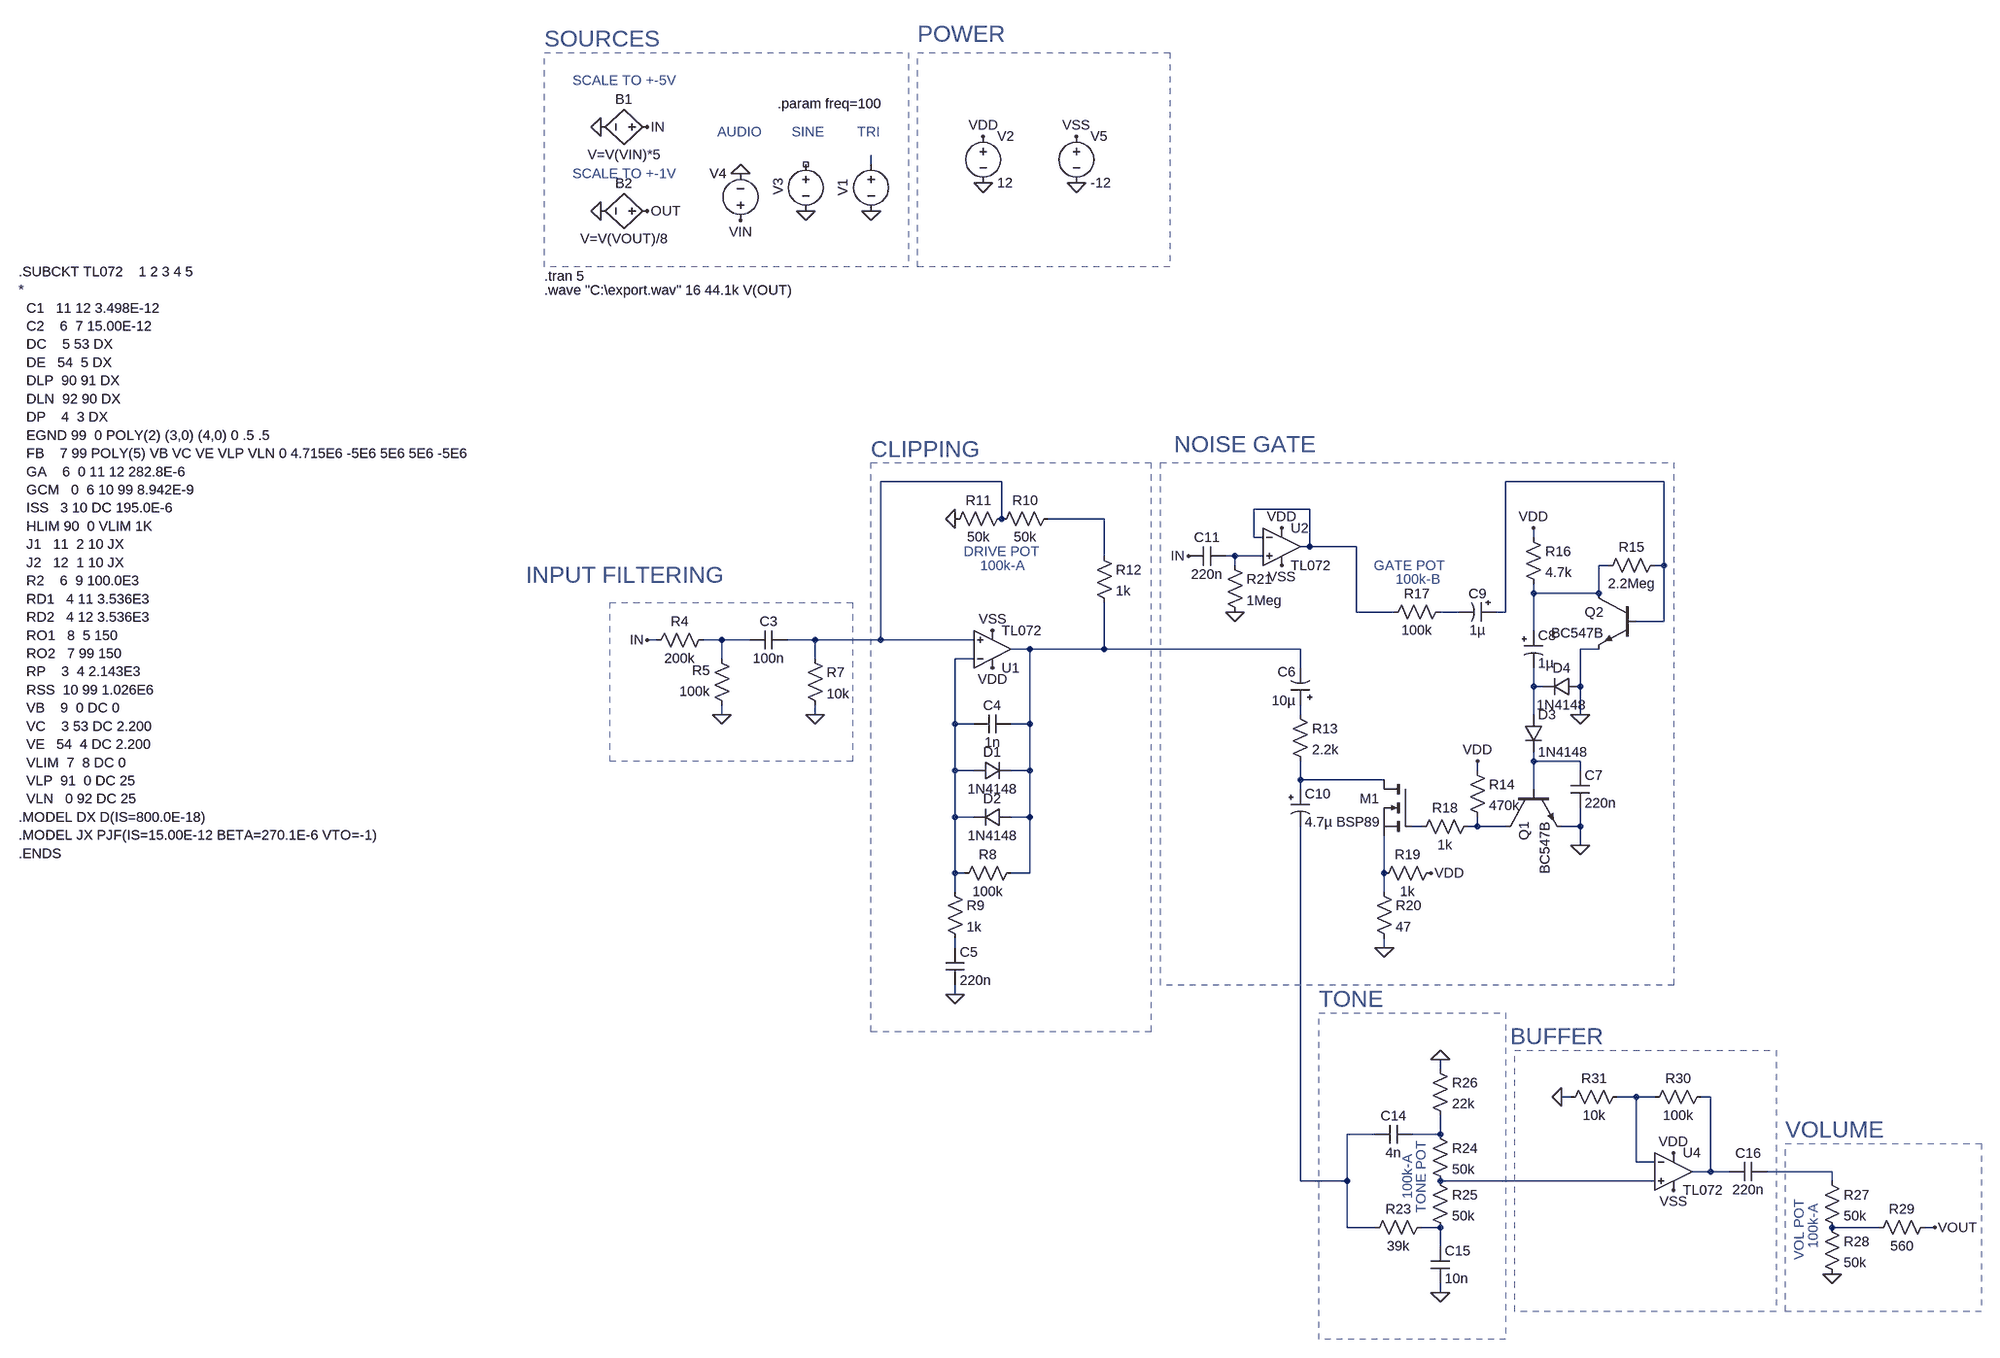
[diagram p0: schematic wrmergle.asc]
wrmergle.asc, the LTspice schematic file:
Version 4
SHEET 1 2852 1756
WIRE -112 -368 -112 -384
WIRE 112 176 -96 176
WIRE 1248 176 976 176
WIRE 640 224 544 224
WIRE 112 240 112 176
WIRE 288 240 192 240
WIRE 544 272 544 224
WIRE 560 272 544 272
WIRE 1024 272 1024 256
WIRE 640 288 640 224
WIRE 640 288 624 288
WIRE 720 288 640 288
WIRE 288 304 288 240
WIRE 512 304 496 304
WIRE 560 304 512 304
WIRE 512 320 512 304
WIRE 1152 320 1136 320
WIRE 1248 320 1248 176
WIRE 1248 320 1232 320
WIRE 1024 368 1024 352
WIRE 1136 368 1136 320
WIRE 1136 368 1024 368
WIRE 720 400 720 288
WIRE 784 400 720 400
WIRE 896 400 864 400
WIRE 976 400 976 176
WIRE 976 400 960 400
WIRE 1248 416 1248 320
WIRE 1248 416 1200 416
WIRE 1024 432 1024 368
WIRE -480 448 -496 448
WIRE -368 448 -400 448
WIRE -320 448 -368 448
WIRE -208 448 -256 448
WIRE -96 448 -96 176
WIRE -96 448 -208 448
WIRE 64 448 -96 448
WIRE 160 464 128 464
WIRE 288 464 288 384
WIRE 288 464 160 464
WIRE 624 464 288 464
WIRE 1136 464 1104 464
WIRE -368 480 -368 448
WIRE -208 480 -208 448
WIRE 64 480 32 480
WIRE 624 496 624 464
WIRE 1024 528 1024 496
WIRE 1040 528 1024 528
WIRE 1104 528 1104 464
WIRE -368 576 -368 560
WIRE -208 576 -208 560
WIRE 624 576 624 560
WIRE 1024 576 1024 528
WIRE 1104 576 1104 528
WIRE 32 592 32 480
WIRE 64 592 32 592
WIRE 160 592 160 464
WIRE 160 592 128 592
WIRE 1024 656 1024 640
WIRE 1104 656 1024 656
WIRE 32 672 32 592
WIRE 64 672 32 672
WIRE 160 672 160 592
WIRE 160 672 128 672
WIRE 928 672 928 656
WIRE 1104 672 1104 656
WIRE 624 688 624 656
WIRE 768 688 624 688
WIRE 624 704 624 688
WIRE 1024 704 1024 656
WIRE 32 752 32 672
WIRE 64 752 32 752
WIRE 160 752 160 672
WIRE 160 752 128 752
WIRE 832 768 816 768
WIRE 928 768 928 752
WIRE 928 768 912 768
WIRE 976 768 928 768
WIRE 1104 768 1104 736
WIRE 1104 768 1072 768
WIRE 1104 800 1104 768
WIRE 32 848 32 752
WIRE 48 848 32 848
WIRE 160 848 160 752
WIRE 160 848 128 848
WIRE 768 848 768 784
WIRE 32 880 32 848
WIRE 768 880 768 848
WIRE 32 976 32 960
WIRE 768 976 768 960
WIRE 32 1056 32 1040
WIRE 864 1184 864 1168
WIRE 1088 1232 1072 1232
WIRE 1200 1232 1168 1232
WIRE 1232 1232 1200 1232
WIRE 1328 1232 1312 1232
WIRE 752 1296 704 1296
WIRE 864 1296 864 1264
WIRE 864 1296 816 1296
WIRE 1200 1344 1200 1232
WIRE 1232 1344 1200 1344
WIRE 1328 1360 1328 1232
WIRE 1328 1360 1296 1360
WIRE 1360 1360 1328 1360
WIRE 1536 1360 1424 1360
WIRE 624 1376 624 768
WIRE 704 1376 704 1296
WIRE 704 1376 624 1376
WIRE 1232 1376 864 1376
WIRE 1536 1376 1536 1360
WIRE 704 1456 704 1376
WIRE 752 1456 704 1456
WIRE 864 1456 832 1456
WIRE 1616 1456 1536 1456
WIRE 1712 1456 1696 1456
WIRE 864 1488 864 1456
WIRE 864 1568 864 1552
FLAG -336 -272 VIN
FLAG -496 -432 IN
FLAG -496 -288 OUT
FLAG -496 448 IN
FLAG 1712 1456 VOUT
FLAG 1264 1328 VDD
FLAG 1264 1392 VSS
FLAG 96 432 VSS
FLAG 96 496 VDD
FLAG 928 656 VDD
FLAG 1024 256 VDD
FLAG 592 256 VDD
FLAG 592 320 VSS
FLAG 848 848 VDD
FLAG 432 304 IN
FLAG 240 -336 0
FLAG 80 -336 0
FLAG 80 -416 VDD
FLAG 240 -416 VSS
FLAG -576 -288 0
FLAG -576 -432 0
FLAG -336 -352 0
FLAG -224 -288 0
FLAG -112 -288 0
FLAG 32 240 0
FLAG 32 1056 0
FLAG -208 576 0
FLAG -368 576 0
FLAG 512 400 0
FLAG 768 976 0
FLAG 1104 800 0
FLAG 1104 576 0
FLAG 864 1568 0
FLAG 864 1168 0
FLAG 1072 1232 0
FLAG 1536 1536 0
SYMBOL voltage -112 -384 R0
WINDOW 0 -32 56 VBottom 2
WINDOW 3 32 56 Invisible 2
WINDOW 123 0 0 Left 0
WINDOW 39 0 0 Left 0
SYMATTR InstName V1
SYMATTR Value PULSE(0 250m 0 {0.5/freq} {0.5/freq} 0 {1/freq})
SYMBOL voltage -224 -384 R0
WINDOW 0 -47 39 VRight 2
WINDOW 3 24 96 Invisible 2
WINDOW 123 0 0 Left 0
WINDOW 39 0 0 Left 0
SYMATTR InstName V3
SYMATTR Value SINE(0 1 {freq})
SYMBOL voltage -336 -256 R180
WINDOW 0 24 96 Left 2
WINDOW 3 24 16 Invisible 2
SYMATTR InstName V4
SYMATTR Value wavefile="C:\input.wav" chan=0
SYMBOL bv -480 -432 R90
WINDOW 0 -32 56 VBottom 2
WINDOW 3 32 56 VTop 2
SYMATTR InstName B1
SYMATTR Value V=V(VIN)*5
SYMBOL bv -480 -288 R90
WINDOW 0 -32 56 VBottom 2
WINDOW 3 32 56 VTop 2
SYMATTR InstName B2
SYMATTR Value V=V(VOUT)/8
SYMBOL res -384 432 R90
WINDOW 0 0 56 VBottom 2
WINDOW 3 32 56 VTop 2
SYMATTR InstName R4
SYMATTR Value 200k
SYMBOL res -352 576 R180
WINDOW 0 36 76 Left 2
WINDOW 3 36 40 Left 2
SYMATTR InstName R5
SYMATTR Value 100k
SYMBOL res 848 1440 R90
WINDOW 0 0 56 VBottom 2
WINDOW 3 32 56 VTop 2
SYMATTR InstName R23
SYMATTR Value 39k
SYMBOL cap 816 1280 R90
WINDOW 0 0 32 VBottom 2
WINDOW 3 32 32 VTop 2
SYMATTR InstName C14
SYMATTR Value 4n
SYMBOL res 848 1280 R0
SYMATTR InstName R24
SYMATTR Value 50k
SYMBOL res 848 1360 R0
SYMATTR InstName R25
SYMATTR Value 50k
SYMBOL res 848 1168 R0
SYMATTR InstName R26
SYMATTR Value 22k
SYMBOL cap 848 1488 R0
SYMATTR InstName C15
SYMATTR Value 10n
SYMBOL cap 1424 1344 R90
WINDOW 0 0 32 VBottom 2
WINDOW 3 32 32 VTop 2
SYMATTR InstName C16
SYMATTR Value 220n
SYMBOL res 1520 1360 R0
SYMATTR InstName R27
SYMATTR Value 50k
SYMBOL res 1520 1440 R0
SYMATTR InstName R28
SYMATTR Value 50k
SYMBOL res 1712 1440 R90
WINDOW 0 0 56 VBottom 2
WINDOW 3 32 56 VTop 2
SYMATTR InstName R29
SYMATTR Value 560
SYMBOL OpAmps\\opamp2 1264 1296 R0
SYMATTR InstName U4
SYMATTR Value TL072
SYMBOL res 1328 1216 R90
WINDOW 0 0 56 VBottom 2
WINDOW 3 32 56 VTop 2
SYMATTR InstName R30
SYMATTR Value 100k
SYMBOL res 1184 1216 R90
WINDOW 0 0 56 VBottom 2
WINDOW 3 32 56 VTop 2
SYMATTR InstName R31
SYMATTR Value 10k
SYMBOL OpAmps\\opamp2 96 528 M180
SYMATTR InstName U1
SYMATTR Value TL072
SYMBOL cap 128 576 R90
WINDOW 0 0 32 VBottom 2
WINDOW 3 32 32 VTop 2
SYMATTR InstName C4
SYMATTR Value 1n
SYMBOL diode 64 688 R270
WINDOW 0 32 32 VTop 2
WINDOW 3 0 32 VBottom 2
SYMATTR InstName D1
SYMATTR Value 1N4148
SYMBOL diode 128 736 R90
WINDOW 0 0 32 VBottom 2
WINDOW 3 32 32 VTop 2
SYMATTR InstName D2
SYMATTR Value 1N4148
SYMBOL res 144 832 R90
WINDOW 0 0 56 VBottom 2
WINDOW 3 32 56 VTop 2
SYMATTR InstName R8
SYMATTR Value 100k
SYMBOL res 16 864 R0
SYMATTR InstName R9
SYMATTR Value 1k
SYMBOL cap 16 976 R0
SYMATTR InstName C5
SYMATTR Value 220n
SYMBOL res 208 224 R90
WINDOW 0 0 56 VBottom 2
WINDOW 3 32 56 VTop 2
SYMATTR InstName R10
SYMATTR Value 50k
SYMBOL res 128 224 R90
WINDOW 0 0 56 VBottom 2
WINDOW 3 32 56 VTop 2
SYMATTR InstName R11
SYMATTR Value 50k
SYMBOL res 272 288 R0
SYMATTR InstName R12
SYMATTR Value 1k
SYMBOL cap -256 432 R90
WINDOW 0 0 32 VBottom 2
WINDOW 3 32 32 VTop 2
SYMATTR InstName C3
SYMATTR Value 100n
SYMBOL res -224 464 R0
SYMATTR InstName R7
SYMATTR Value 10k
SYMBOL polcap 640 560 R180
WINDOW 0 24 57 Left 2
WINDOW 3 24 8 Left 2
SYMATTR InstName C6
SYMATTR Value 10µ
SYMBOL res 608 560 R0
SYMATTR InstName R13
SYMATTR Value 2.2k
SYMBOL nmos 816 688 M0
SYMATTR InstName M1
SYMATTR Value BSP89
SYMBOL res 912 656 R0
SYMATTR InstName R14
SYMATTR Value 470k
SYMBOL npn 976 704 M90
SYMATTR InstName Q1
SYMATTR Value BC547B
SYMBOL cap 1088 672 R0
SYMATTR InstName C7
SYMATTR Value 220n
SYMBOL diode 1008 576 R0
SYMATTR InstName D3
SYMATTR Value 1N4148
SYMBOL diode 1104 512 R90
WINDOW 0 0 32 VBottom 2
WINDOW 3 32 32 VTop 2
SYMATTR InstName D4
SYMATTR Value 1N4148
SYMBOL polcap 1008 432 R0
SYMATTR InstName C8
SYMATTR Value 1µ
SYMBOL npn 1200 368 M0
SYMATTR InstName Q2
SYMATTR Value BC547B
SYMBOL res 1248 304 R90
WINDOW 0 0 56 VBottom 2
WINDOW 3 32 56 VTop 2
SYMATTR InstName R15
SYMATTR Value 2.2Meg
SYMBOL res 1008 256 R0
SYMATTR InstName R16
SYMATTR Value 4.7k
SYMBOL polcap 960 384 R90
WINDOW 0 0 32 VBottom 2
WINDOW 3 32 32 VTop 2
SYMATTR InstName C9
SYMATTR Value 1µ
SYMBOL res 880 384 R90
WINDOW 0 0 56 VBottom 2
WINDOW 3 32 56 VTop 2
SYMATTR InstName R17
SYMATTR Value 100k
SYMBOL OpAmps\\opamp2 592 224 R0
SYMATTR InstName U2
SYMATTR Value TL072
SYMBOL polcap 608 704 R0
SYMATTR InstName C10
SYMATTR Value 4.7µ
SYMBOL res 928 752 R90
WINDOW 0 0 56 VBottom 2
WINDOW 3 32 56 VTop 2
SYMATTR InstName R18
SYMATTR Value 1k
SYMBOL res 864 832 R90
WINDOW 0 0 56 VBottom 2
WINDOW 3 32 56 VTop 2
SYMATTR InstName R19
SYMATTR Value 1k
SYMBOL res 752 864 R0
SYMATTR InstName R20
SYMATTR Value 47
SYMBOL cap 496 288 R90
WINDOW 0 0 32 VBottom 2
WINDOW 3 32 32 VTop 2
SYMATTR InstName C11
SYMATTR Value 220n
SYMBOL res 496 304 R0
SYMATTR InstName R21
SYMATTR Value 1Meg
SYMBOL voltage 80 -432 R0
WINDOW 123 0 0 Left 0
WINDOW 39 0 0 Left 0
SYMATTR InstName V2
SYMATTR Value 12
SYMBOL voltage 240 -432 R0
WINDOW 123 0 0 Left 0
WINDOW 39 0 0 Left 0
SYMATTR InstName V5
SYMATTR Value -12
TEXT -272 -472 Left 2 !.param freq=100
TEXT -248 -424 Left 2 ;SINE
TEXT -136 -424 Left 2 ;TRI
TEXT -376 -424 Left 2 ;AUDIO
TEXT -672 -584 Left 4 ;SOURCES
TEXT -32 -592 Left 4 ;POWER
TEXT -624 -512 Left 2 ;SCALE TO +-5V
TEXT -624 -352 Left 2 ;SCALE TO +-1V
TEXT -672 -176 Left 2 !.tran 5
TEXT -672 -152 Left 2 !.wave "C:\\export.wav" 16 44.1k V(OUT)
TEXT -1584 -184 Left 2 !.SUBCKT TL072    1 2 3 4 5\n*\n  C1   11 12 3.498E-12\n  C2    6  7 15.00E-12\n  DC    5 53 DX\n  DE   54  5 DX\n  DLP  90 91 DX\n  DLN  92 90 DX\n  DP    4  3 DX\n  EGND 99  0 POLY(2) (3,0) (4,0) 0 .5 .5\n  FB    7 99 POLY(5) VB VC VE VLP VLN 0 4.715E6 -5E6 5E6 5E6 -5E6\n  GA    6  0 11 12 282.8E-6\n  GCM   0  6 10 99 8.942E-9\n  ISS   3 10 DC 195.0E-6\n  HLIM 90  0 VLIM 1K\n  J1   11  2 10 JX\n  J2   12  1 10 JX\n  R2    6  9 100.0E3\n  RD1   4 11 3.536E3\n  RD2   4 12 3.536E3\n  RO1   8  5 150\n  RO2   7 99 150\n  RP    3  4 2.143E3\n  RSS  10 99 1.026E6\n  VB    9  0 DC 0\n  VC    3 53 DC 2.200\n  VE   54  4 DC 2.200\n  VLIM  7  8 DC 0\n  VLP  91  0 DC 25\n  VLN   0 92 DC 25\n.MODEL DX D(IS=800.0E-18)\n.MODEL JX PJF(IS=15.00E-12 BETA=270.1E-6 VTO=-1)\n.ENDS
TEXT -704 336 Left 4 ;INPUT FILTERING
TEXT 656 1064 Left 4 ;TONE
TEXT 1480 1408 VRight 2 ;VOL POT
TEXT 1504 1416 VRight 2 ;100k-A
TEXT 984 1128 Left 4 ;BUFFER
TEXT 1456 1288 Left 4 ;VOLUME
TEXT -112 120 Left 4 ;CLIPPING
TEXT 176 296 Right 2 ;DRIVE POT
TEXT 152 320 Right 2 ;100k-A
TEXT 832 1432 VLeft 2 ;TONE POT
TEXT 808 1408 VLeft 2 ;100k-A
TEXT 872 320 Right 2 ;GATE POT
TEXT 864 344 Right 2 ;100k-B
TEXT 408 112 Left 4 ;NOISE GATE
RECTANGLE Normal 400 -192 -32 -560 1
RECTANGLE Normal -48 -192 -672 -560 1
RECTANGLE Normal -144 656 -560 384 1
RECTANGLE Normal 976 1648 656 1088 1
RECTANGLE Normal 1440 1600 992 1152 1
RECTANGLE Normal 1792 1600 1456 1312 1
RECTANGLE Normal 368 1120 -112 144 1
RECTANGLE Normal 1264 1040 384 144 1

The netlist it stands for:
* wrmergle.asc
V1 N001 0 PULSE(0 250m 0 {0.5/freq} {0.5/freq} 0 {1/freq})
V3 NC_01 0 SINE(0 1 {freq})
V4 VIN 0 wavefile="C:\input.wav" chan=0
B1 IN 0 V=V(VIN)*5
B2 OUT 0 V=V(VOUT)/8
R4 N009 IN 200k
R5 0 N009 100k
R23 N026 N022 39k
C14 N023 N022 4n
R24 N023 N025 50k
R25 N025 N026 50k
R26 0 N023 22k
C15 N026 0 10n
C16 N024 N021 220n
R27 N024 N027 50k
R28 N027 0 50k
R29 VOUT N027 560
XU4 N025 N020 VDD VSS N021 TL072  ; pins In+ In- V+ V- OUT
R30 N021 N020 100k
R31 N020 0 10k
XU1 N002 N011 VDD VSS N010 TL072  ; pins In+ In- V+ V- OUT
C4 N010 N011 1n
D1 N011 N010 1N4148
D2 N010 N011 1N4148
R8 N010 N011 100k
R9 N011 N019 1k
C5 N019 0 220n
R10 N005 N002 50k
R11 N002 0 50k
R12 N005 N010 1k
C3 N002 N009 100n
R7 N002 0 10k
C6 N013 N010 10µ
R13 N013 N015 2.2k
M1 N015 N016 N018 N018 BSP89
R14 VDD N017 470k
Q1 N017 N014 0 0 BC547B
C7 N014 0 220n
D3 N012 N014 1N4148
D4 0 N012 1N4148
C8 N007 N012 1µ
Q2 N007 N003 0 0 BC547B
R15 N003 N007 2.2Meg
R16 VDD N007 4.7k
C9 N003 N008 1µ
R17 N008 N004 100k
XU2 N006 N004 VDD VSS N004 TL072  ; pins In+ In- V+ V- OUT
C10 N015 N022 4.7µ
R18 N017 N016 1k
R19 VDD N018 1k
R20 N018 0 47
C11 N006 IN 220n
R21 N006 0 1Meg
V2 VDD 0 12
V5 VSS 0 -12
.model D D
.lib standard.dio
.model NPN NPN
.model PNP PNP
.lib standard.bjt
.model NMOS NMOS
.model PMOS PMOS
.lib standard.mos
.param freq=100
* SINE
* TRI
* AUDIO
* SOURCES
* POWER
* SCALE TO +-5V
* SCALE TO +-1V
.tran 5
.wave "C:\export.wav" 16 44.1k V(OUT)
.SUBCKT TL072    1 2 3 4 5
*
  C1   11 12 3.498E-12
  C2    6  7 15.00E-12
  DC    5 53 DX
  DE   54  5 DX
  DLP  90 91 DX
  DLN  92 90 DX
  DP    4  3 DX
  EGND 99  0 POLY(2) (3,0) (4,0) 0 .5 .5
  FB    7 99 POLY(5) VB VC VE VLP VLN 0 4.715E6 -5E6 5E6 5E6 -5E6
  GA    6  0 11 12 282.8E-6
  GCM   0  6 10 99 8.942E-9
  ISS   3 10 DC 195.0E-6
  HLIM 90  0 VLIM 1K
  J1   11  2 10 JX
  J2   12  1 10 JX
  R2    6  9 100.0E3
  RD1   4 11 3.536E3
  RD2   4 12 3.536E3
  RO1   8  5 150
  RO2   7 99 150
  RP    3  4 2.143E3
  RSS  10 99 1.026E6
  VB    9  0 DC 0
  VC    3 53 DC 2.200
  VE   54  4 DC 2.200
  VLIM  7  8 DC 0
  VLP  91  0 DC 25
  VLN   0 92 DC 25
.MODEL DX D(IS=800.0E-18)
.MODEL JX PJF(IS=15.00E-12 BETA=270.1E-6 VTO=-1)
.ENDS
* INPUT FILTERING
* TONE
* VOL POT
* 100k-A
* BUFFER
* VOLUME
* CLIPPING
* DRIVE POT
* 100k-A
* TONE POT
* 100k-A
* GATE POT
* 100k-B
* NOISE GATE
.backanno
.end